# EAGLE design mainboard (EAGLE 5.10)
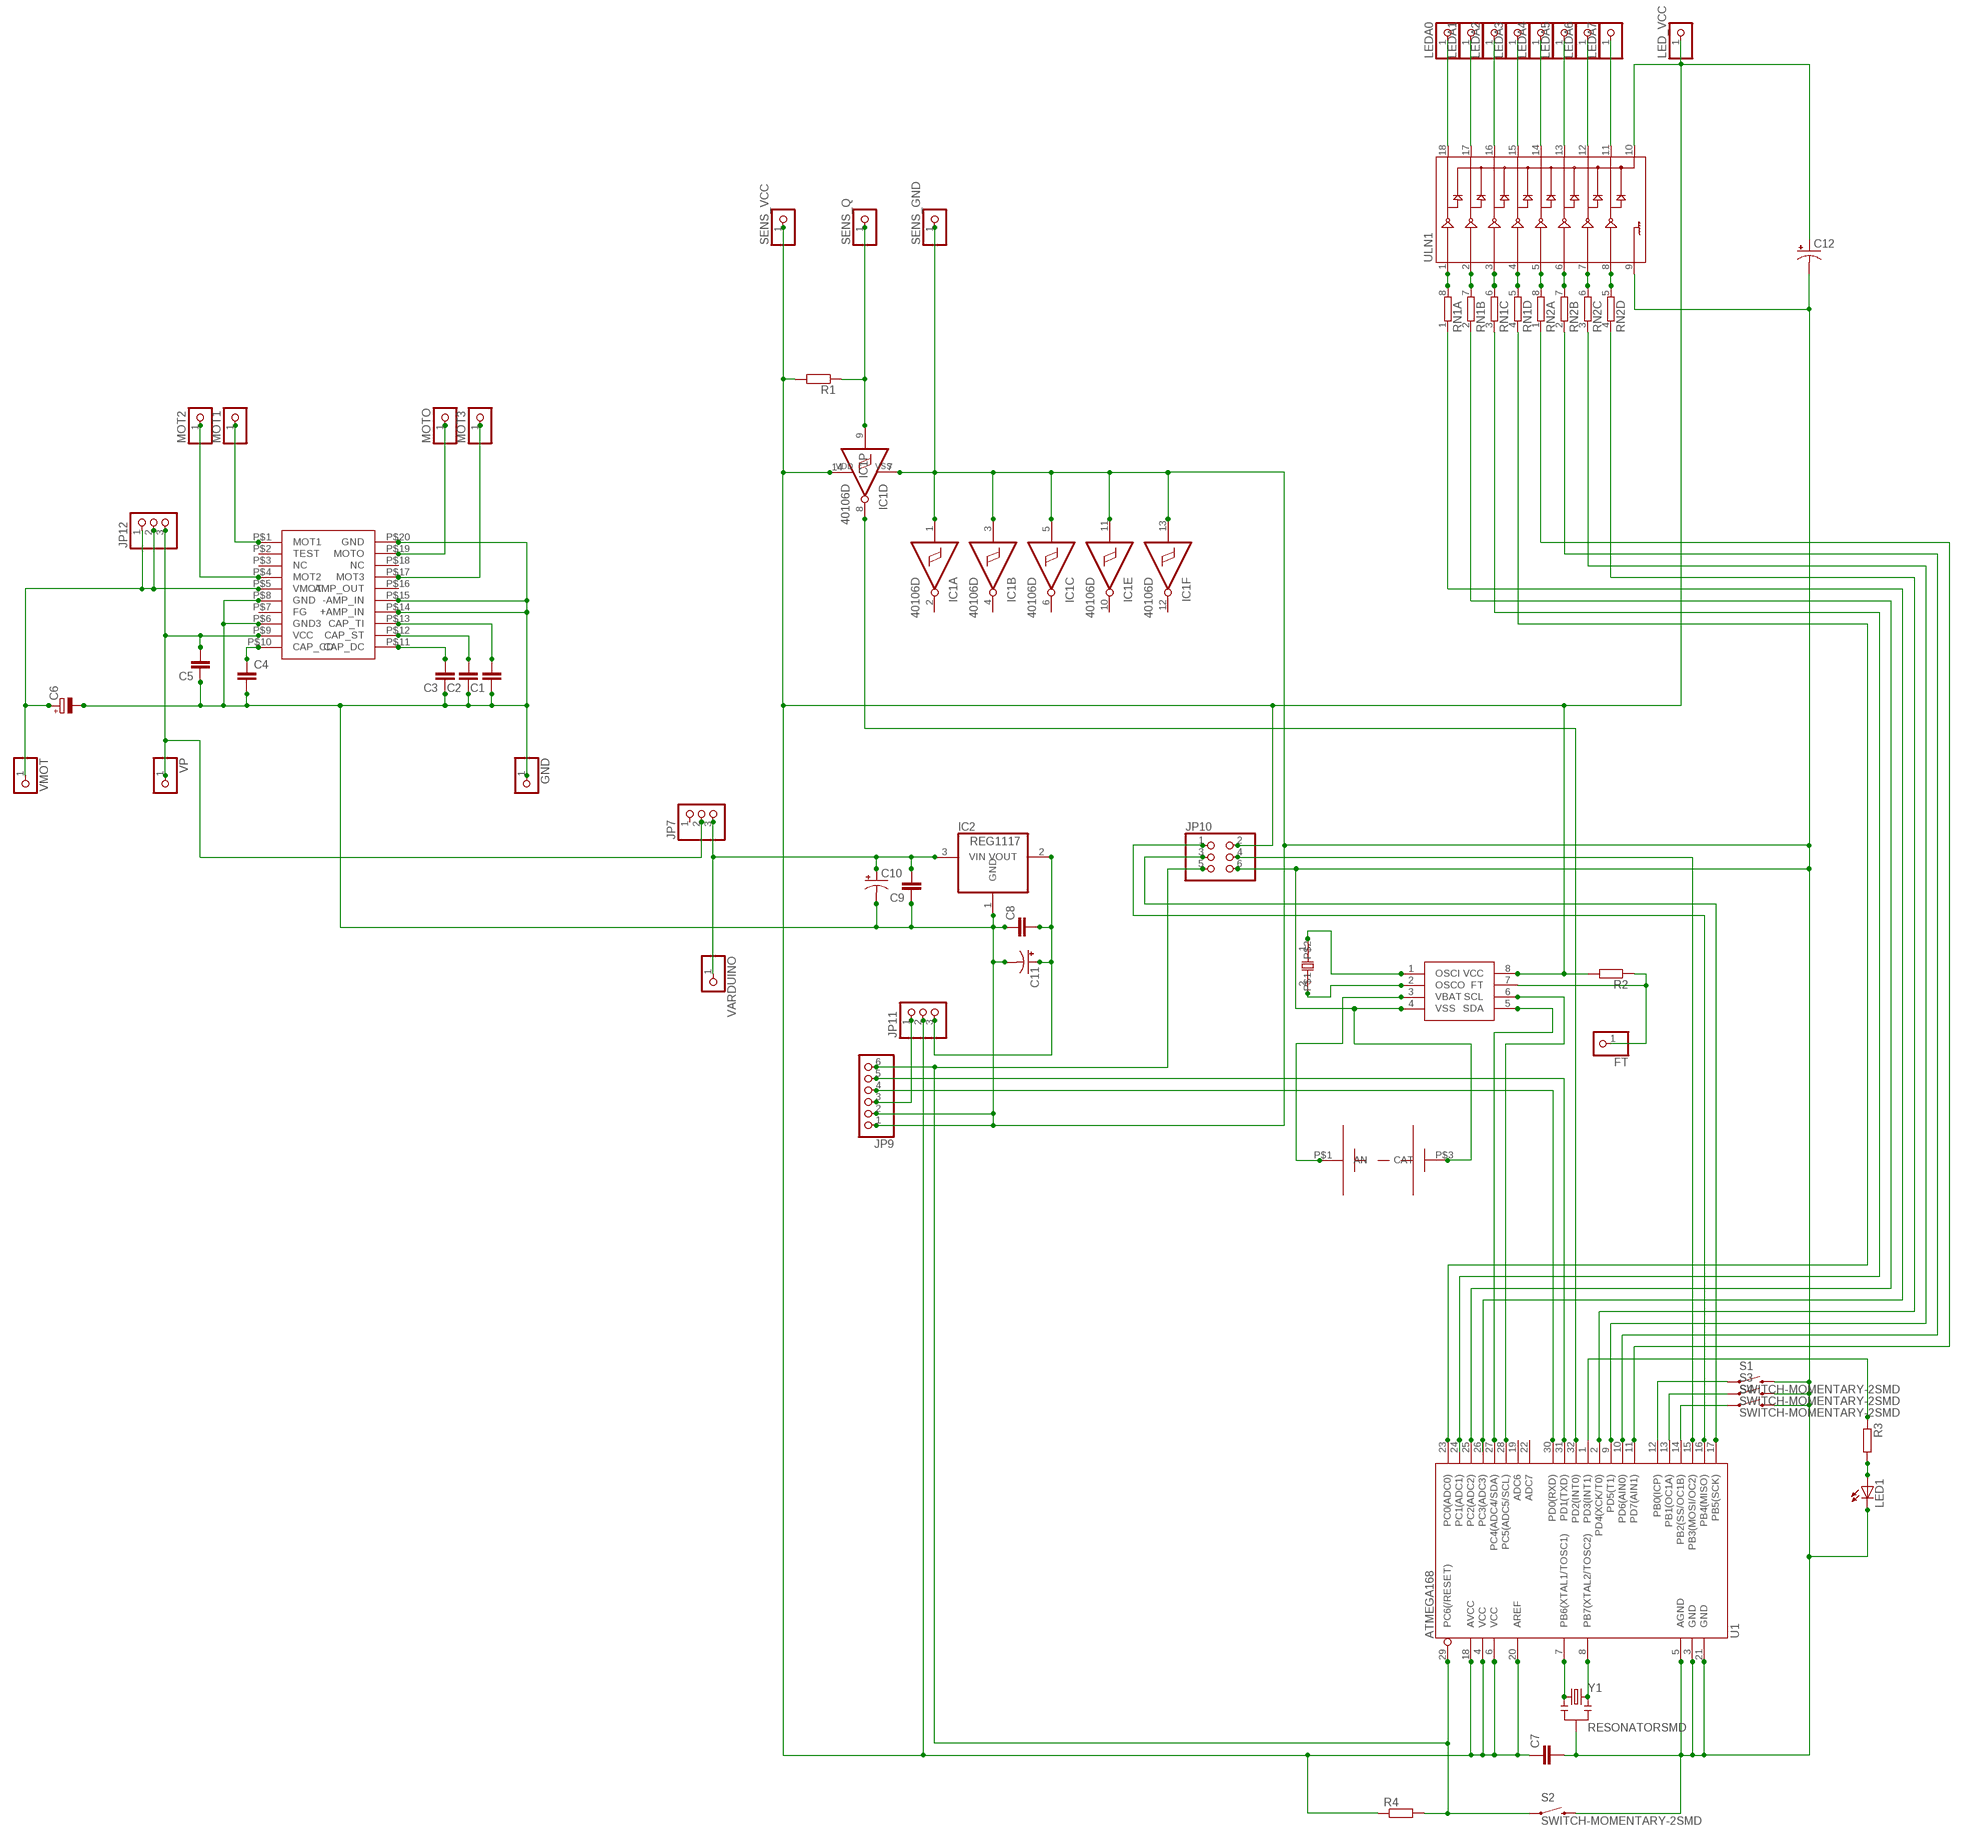
[diagram p0: schematic, sheet 1]

## Parts
C1  C-EUC0805  [C0805]
C2  C-EUC0805  [C0805]
C3  C-EUC0805  [C0805]
C4  C-EUC0805  [C0805]
C5  C-EUC0805  [C0805]
C6  CPOL-EUSMCD  [SMC_D]
C7  C-EUC0805  [C0805]
C8  C-EUC0805  [C0805]
C9  C-EUC0805  [C0805]
C10  CAP_POL3528  [EIA3528]
C11  CAP_POL3528  [EIA3528]
C12  CAP_POL3528  [EIA3528]
FT  PINHD-1X1  [1X01]
GND  PINHD-1X1  [1X01]
IC1  40106D  [SO14]
IC2  REG1117  [SOT223]
JP7  PINHD-1X3  [1X03]
JP9  PINHD-1X6  [1X06]
JP10  PINHD-2X3  [2X03]
JP11  PINHD-1X3  [1X03]
JP12  PINHD-1X3  [1X03]
LED1  LEDCHIP-LED0805  [CHIP-LED0805]
LED_VCC  PINHD-1X1  [1X01]
LEDA0  PINHD-1X1  [1X01]
LEDA1  PINHD-1X1  [1X01]
LEDA2  PINHD-1X1  [1X01]
LEDA3  PINHD-1X1  [1X01]
LEDA4  PINHD-1X1  [1X01]
LEDA5  PINHD-1X1  [1X01]
LEDA6  PINHD-1X1  [1X01]
LEDA7  PINHD-1X1  [1X01]
MOT1  PINHD-1X1  [1X01]
MOT2  PINHD-1X1  [1X01]
MOT3  PINHD-1X1  [1X01]
MOTO  PINHD-1X1  [1X01]
R1  R-EU_R0805  [R0805]
R2  R-EU_R0805  [R0805]
R3  R-EU_R0805  [R0805]
R4  R-EU_R0805  [R0805]
RN1  4R-N0603-ARV  [0603-ARV]
RN2  4R-N0603-ARV  [0603-ARV]
S1  SWITCH-MOMENTARY-2SMD  [TACTILE_SWITCH_SMD]
S2  SWITCH-MOMENTARY-2SMD  [TACTILE_SWITCH_SMD]
S3  SWITCH-MOMENTARY-2SMD  [TACTILE_SWITCH_SMD]
S4  SWITCH-MOMENTARY-2SMD  [TACTILE_SWITCH_SMD]
SENS_GND  PINHD-1X1  [1X01]
SENS_Q  PINHD-1X1  [1X01]
SENS_VCC  PINHD-1X1  [1X01]
U1  ATMEGA168  [TQFP32-08]
U$1  TDA5144  [SO20W]
U$2  M41T00RTC  [SO08]
U$3  SSP-T5XTAL  [SSP-T5XTAL]
U$4  CR1216LITHIUM  [CR1216]
ULN1  ULN2803SOICW  [SO18L]
VARDUINO  PINHD-1X1  [1X01]
VMOT  PINHD-1X1  [1X01]
VP  PINHD-1X1  [1X01]
Y1  RESONATORSMD  [RESONATOR-SMD]

## Nets
5V: C7.1 C12.A(+) IC1.14(P:VDD) JP10.2 JP11.2 LED_VCC.1 R1.2 R2.2 R4.1 SENS_VCC.1 U1.4(VCC) U1.6(VCC) U1.18(AVCC) U1.20(AREF) U$2.8(VCC) ULN1.10
GND: C1.1 C2.1 C3.1 C4.2 C5.1 C6.- C7.2 C8.1 C9.1 C10.C(-) C11.C(-) C12.C(-) GND.1 IC1.1(A:I) IC1.3(B:I) IC1.5(C:I) IC1.7(P:VSS) IC1.11(E:I) IC1.13(F:I) IC2.1(GND) JP9.1 JP9.2 JP10.6 LED1.C S1.3 S2.3 S3.3 S4.3 SENS_GND.1 U1.3(GND) U1.5(AGND) U1.21(GND) U$1.P$6(GND3) U$1.P$8(GND) U$1.P$14(+AMP_IN) U$1.P$15(-AMP_IN) U$1.P$20(GND) U$2.4(VSS) U$4.P$3(CAT) ULN1.9 Y1.2
N$1: MOT1.1 U$1.P$1(MOT1)
N$2: MOT2.1 U$1.P$4(MOT2)
N$3: MOTO.1 U$1.P$19(MOTO)
N$4: MOT3.1 U$1.P$17(MOT3)
N$5: RN1.8 ULN1.1
N$6: RN1.7 ULN1.2
N$7: RN1.6 ULN1.3
N$8: RN2.1 U1.11(PD7(AIN1))
N$9: C1.2 U$1.P$13(CAP_TI)
N$10: C2.2 U$1.P$12(CAP_ST)
N$11: C3.2 U$1.P$11(CAP_DC)
N$12: C4.1 U$1.P$10(CAP_CD)
N$13: RN1.5 ULN1.4
N$14: RN2.8 ULN1.5
N$15: RN2.7 ULN1.6
N$16: RN2.6 ULN1.7
N$17: RN2.5 ULN1.8
N$18: LEDA0.1 ULN1.18
N$19: LEDA1.1 ULN1.17
N$20: LEDA2.1 ULN1.16
N$21: LEDA3.1 ULN1.15
N$22: LEDA4.1 ULN1.14
N$23: LEDA5.1 ULN1.13
N$24: LEDA6.1 ULN1.12
N$25: LEDA7.1 ULN1.11
N$26: S3.1 U1.13(PB1(OC1A))
N$27: U1.28(PC5(ADC5/SCL)) U$2.6(SCL)
N$28: IC1.9(D:I) R1.1 SENS_Q.1
N$30: U1.7(PB6(XTAL1/TOSC1)) Y1.1
N$31: U1.8(PB7(XTAL2/TOSC2)) Y1.3
N$32: JP9.3 JP11.1
N$33: C8.2 C11.A(+) IC2.2(VOUT) JP11.3
N$34: JP9.5 U1.31(PD1(TXD))
N$35: JP9.4 U1.30(PD0(RXD))
N$36: JP10.3 U1.17(PB5(SCK))
N$37: JP10.1 U1.16(PB4(MISO))
N$38: JP10.4 U1.15(PB3(MOSI/OC2))
N$39: IC1.8(D:O) U1.32(PD2(INT0))
N$40: RN1.4 U1.23(PC0(ADC0))
N$41: C9.2 C10.A(+) IC2.3(VIN) JP7.3 VARDUINO.1
N$42: RN1.3 U1.24(PC1(ADC1))
N$43: RN1.2 U1.25(PC2(ADC2))
N$44: RN1.1 U1.26(PC3(ADC3))
N$45: RN2.4 U1.2(PD4(XCK/T0))
N$46: RN2.3 U1.9(PD5(T1))
N$47: RN2.2 U1.10(PD6(AIN0))
N$48: C6.+ JP12.1 JP12.2 U$1.P$5(VMOT) VMOT.1
N$49: U1.27(PC4(ADC4/SDA)) U$2.5(SDA)
N$51: U$2.1(OSCI) U$3.1
N$52: U$2.2(OSCO) U$3.2
N$53: FT.1 R2.1 U$2.7(FT)
N$55: R3.1 U1.1(PD3(INT1))
N$56: LED1.A R3.2
N$57: S4.1 U1.14(PB2(SS/OC1B))
N$58: S1.1 U1.12(PB0(ICP))
RESET: JP9.6 JP10.5 R4.2 S2.1 U1.29(PC6(/RESET))
VBAT: U$2.3(VBAT) U$4.P$1(AN)
VCC: C5.2 JP7.2 JP12.3 U$1.P$9(VCC) VP.1
Unconnected: IC1.2(A:O) IC1.4(B:O) IC1.6(C:O) IC1.10(E:O) IC1.12(F:O) JP7.1 U1.19(ADC6) U1.22(ADC7) U$1.P$2(TEST) U$1.P$3(NC) U$1.P$7(FG) U$1.P$16(AMP_OUT) U$1.P$18(NC)

## Library data of the parts
C1-C5 C7-C9 = rcl:C-EU: CAPACITOR, European symbol
C6 = rcl:CPOL-EU: POLARIZED CAPACITOR, European symbol
C10-C12 = SparkFun:CAP_POL: Capacitor Polarized These are standard SMD and PTH capacitors. Normally 10uF, 47uF, and 100uF in electrolytic and tantalum varieties. Always verify the external diameter of the through hole cap, it varies with capacity, voltage, and manufacturer. The EIA devices should be standard.
FT GND LED_VCC LEDA0 LEDA1-LEDA7 MOT1-MOT3 MOTO SENS_GND SENS_Q SENS_VCC VARDUINO VMOT VP = pinhead:PINHD-1X1: PIN HEADER
IC1 = 40xx:40106: Hex SCHMITT TRIGGER
IC2 = burr-brown:REG1117: 800mA and 1A Low Dropout (LDO) Positive Regulator 1.8V, 2.5V, 2.85V, 3.3V, 5V, and Adj
JP7 JP11 JP12 = pinhead:PINHD-1X3: PIN HEADER
JP9 = pinhead:PINHD-1X6: PIN HEADER
JP10 = pinhead:PINHD-2X3: PIN HEADER
LED1 = led:LED: LED OSRAM: - CHIPLED LG R971, LG N971, LY N971, LG Q971, LY Q971, LO R971, LY R971 LH N974, LH R974 LS Q976, LO Q976, LY Q976 LO Q996 - Hyper CHIPLED LW Q18S LB Q993, LB Q99A, LB R99A - SideLED LS A670, LO A670, LY A670, LG A670, LP A670 LB A673, LV A673, LT A673, LW A673 LH A674 LY A675 LS A676, LA A676, LO A676, LY A676, LW A676 LS A679, LY A679, LG A679 - Hyper Micro SIDELED® LS Y876, LA Y876, LO Y876, LY Y876 LT Y87S - SmartLED LW L88C, LW L88S LB L89C, LB L89S, LG L890 LS L89K, LO L89K, LY L89K LS L896, LA L896, LO L896, LY L896 - TOPLED LS T670, LO T670, LY T670, LG T670, LP T670 LSG T670, LSP T670, LSY T670, LOP T670, LYG T670 LG T671, LOG T671, LSG T671 LB T673, LV T673, LT T673, LW T673 LH T674 LS T676, LA T676, LO T676, LY T676, LB T676, LH T676, LSB T676, LW T676 LB T67C, LV T67C, LT T67C, LS T67K, LO T67K, LY T67K, LW E67C LS E67B, LA E67B, LO E67B, LY E67B, LB E67C, LV E67C, LT E67C LW T67C LS T679, LY T679, LG T679 LS T770, LO T770, LY T770, LG T770, LP T770 LB T773, LV T773, LT T773, LW T773 LH T774 LS E675, LA E675, LY E675, LS T675 LS T776, LA T776, LO T776, LY T776, LB T776 LHGB T686 LT T68C, LB T68C - Hyper Mini TOPLED® LB M676 - Mini TOPLED Santana® LG M470 LS M47K, LO M47K, LY M47K Source: http://www.osram.convergy.de LUXEON: - LUMILED® LXK2-PW12-R00, LXK2-PW12-S00, LXK2-PW14-U00, LXK2-PW14-V00 LXK2-PM12-R00, LXK2-PM12-S00, LXK2-PM14-U00 LXK2-PE12-Q00, LXK2-PE12-R00, LXK2-PE12-S00, LXK2-PE14-T00, LXK2-PE14-U00 LXK2-PB12-K00, LXK2-PB12-L00, LXK2-PB12-M00, LXK2-PB14-N00, LXK2-PB14-P00, LXK2-PB14-Q00 LXK2-PR12-L00, LXK2-PR12-M00, LXK2-PR14-Q00, LXK2-PR14-R00 LXK2-PD12-Q00, LXK2-PD12-R00, LXK2-PD12-S00 LXK2-PH12-R00, LXK2-PH12-S00 LXK2-PL12-P00, LXK2-PL12-Q00, LXK2-PL12-R00 Source: www.luxeon.com KINGBRIGHT: KA-3528ASYC Source: www.kingbright.com
R1-R4 = rcl:R-EU_: RESISTOR, European symbol
RN1 RN2 = resistor-dil:4R-N: Array Chip Resistor Source: RS Component / Phycomp
S1-S4 = SparkFun:SWITCH-MOMENTARY-2
U1 = SparkFun:ATMEGA168
U$1 = jasons_stuff:TDA5144
U$2 = jasons_stuff:M41T00RTC
U$3 = jasons_stuff:SSP-T5XTAL
U$4 = jasons_stuff:CR1216LITHIUM
ULN1 = SparkFun:ULN2803: Darlington Driver ULN2803 Darlington array. 500mA max per channel, 8-channel package. Spark Fun Electronics SKU : COM-00312
Y1 = SparkFun:RESONATOR: Resonator Small SMD resonator. This is the itty bitty 10/20MHz resonators with built in caps. CSTCE10M0G55 and CSTCE20M0V53. Footprint has been reviewed closely but hasn't been tested yet.

## Board
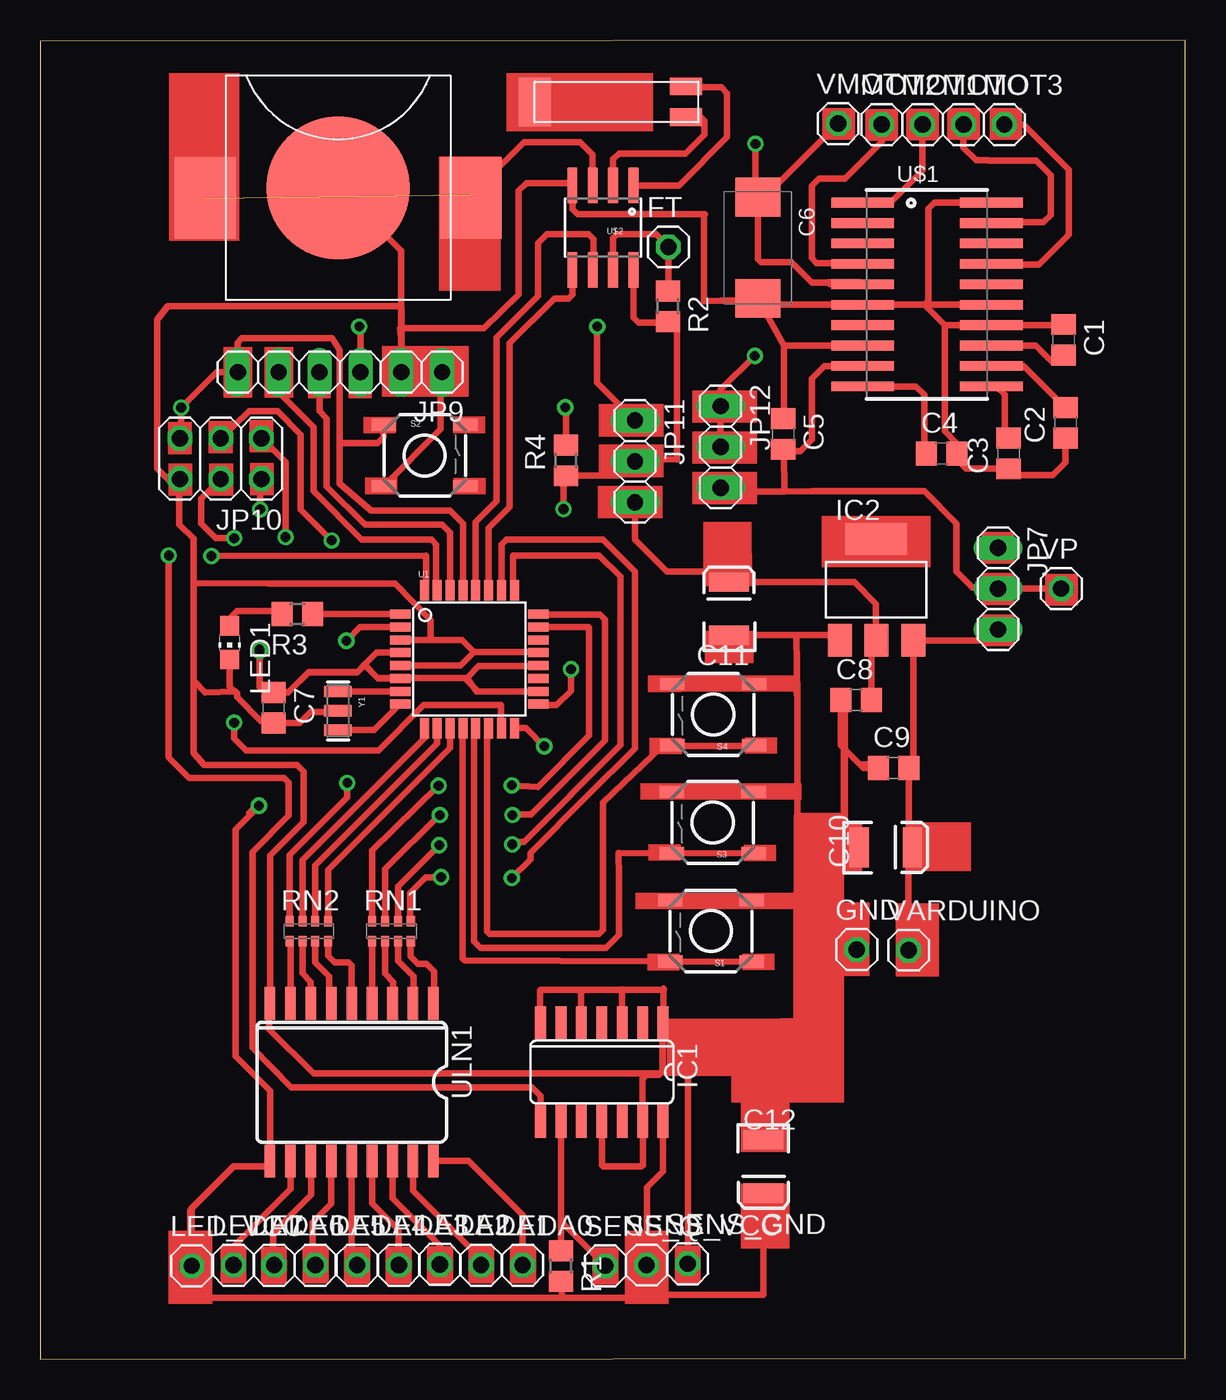
[diagram p1: board, top side]
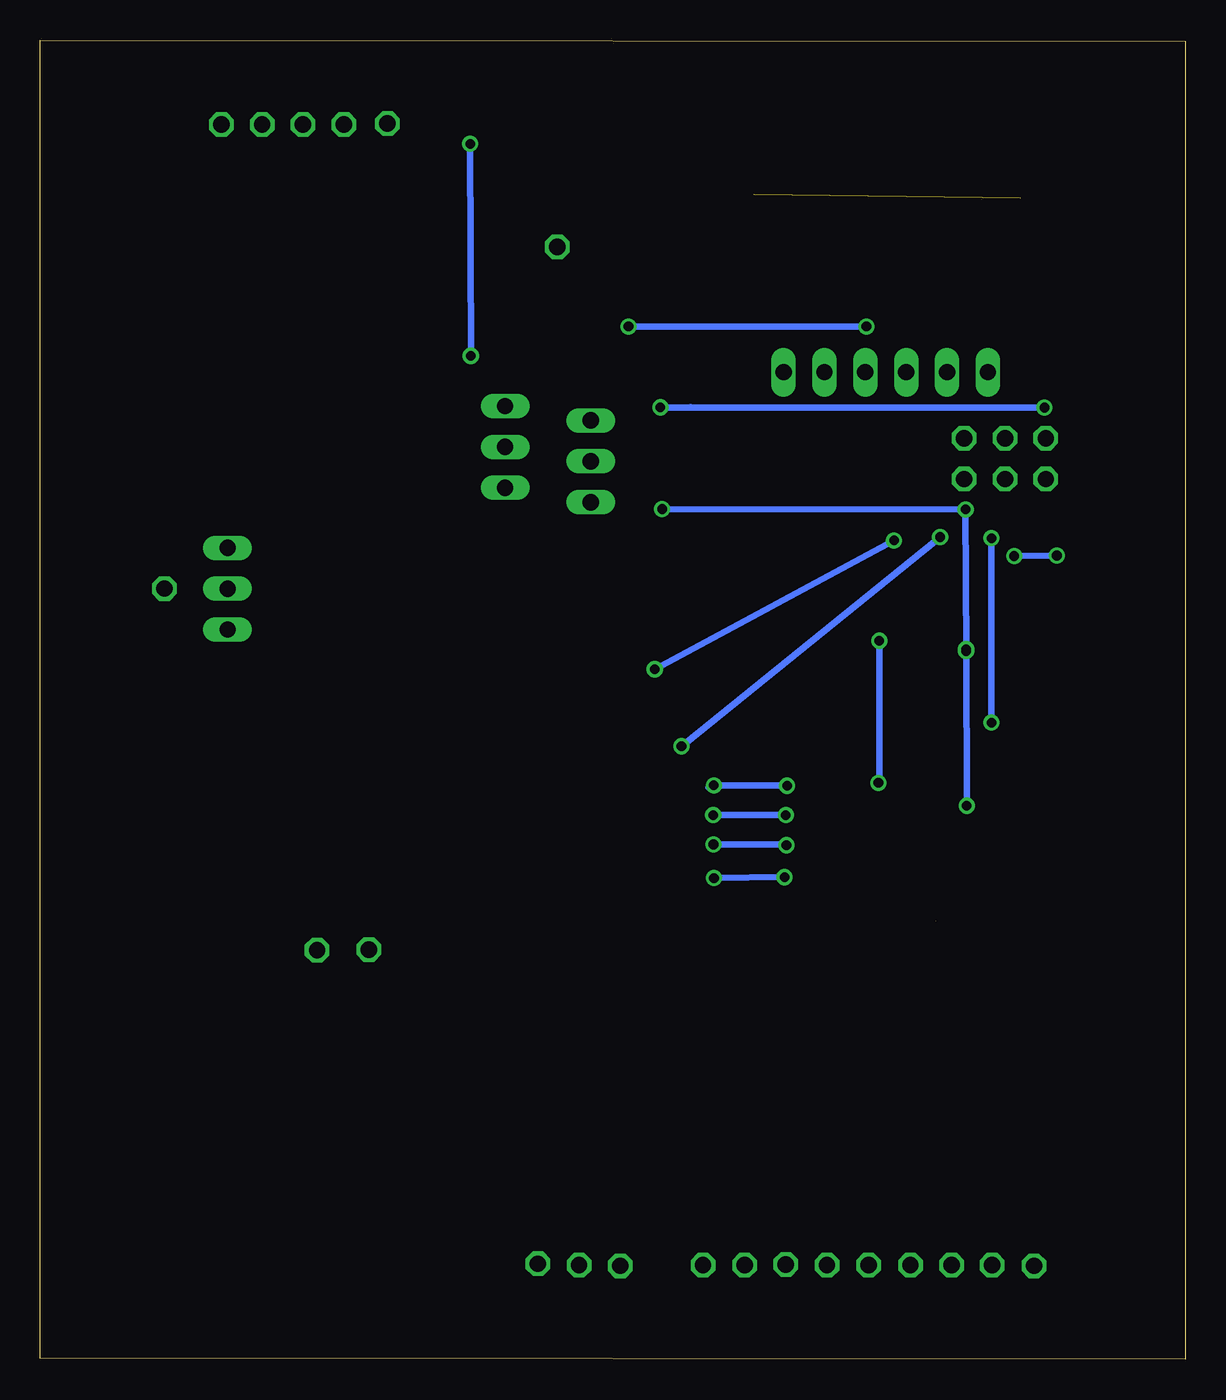
[diagram p2: board, bottom side, seen from below]

Size 71.25 x 82.06 mm. Coordinates in mm from the lower left corner, seen from the top.
Outline: 0,0 71.25,0.06 71.25,82.06 0,82 0,0
Copper layers (1*16): Top 0.035mm / dielectric 1.5mm / Bottom 0.035mm
Design rules "default": minimum track width 10mil, minimum drill 24mil, track to track 8mil, track to pad 8mil, pad to pad 8mil, via to via 8mil, smd to smd 8mil, copper to edge 40mil, drill to drill 8mil, minimum pad ring 10mil, minimum via ring 8mil, stop-mask expansion 4mil, vias tented up to drill 0mil, thermal gap 10mil

### Footprints (pad centres in the part's own frame; a part is rotated, then mirrored left to right if it is on the bottom)
C0805 = smd 1.3 x 1.5: 1 -0.95,0; 2 0.95,0
SMC_D = smd 2.4 x 2.8: + -3.15,0; - 3.15,0
EIA3528 = smd 1.2 x 2.5: A 1.65,0; C -1.65,0
1X01 = drill 1.016 octagon: 1 0,0
SO14 = smd 0.66 x 2.032: 1 -3.81,-3.073; 2 -2.54,-3.073; 3 -1.27,-3.073; 4 0,-3.073; 5 1.27,-3.073; 6 2.54,-3.073; 7 3.81,-3.073; 8 3.81,3.073; 9 2.54,3.073; 10 1.27,3.073; 11 0,3.073; 12 -1.27,3.073; 13 -2.54,3.073; 14 -3.81,3.073
SOT223 = smd 1.499 x 2.007: 1 -2.261,-3.15; 2 0.025,-3.15; 3 2.311,-3.15 | smd 3.81 x 2.007: 4 0,3.15
1X03 = drill 1.016 long: 1 -2.54,0; 2 0,0; 3 2.54,0
1X06 = drill 1.016 long: 1 -6.35,0; 2 -3.81,0; 3 -1.27,0; 4 1.27,0; 5 3.81,0; 6 6.35,0
2X03 = drill 1.016 octagon: 1 -2.54,-1.27; 2 -2.54,1.27; 3 0,-1.27; 4 0,1.27; 5 2.54,-1.27; 6 2.54,1.27
CHIP-LED0805 = smd 1.2 x 1.2: A 0,-1.05; C 0,1.05
R0805 = smd 1.3 x 1.5: 1 -0.95,0; 2 0.95,0
0603-ARV = smd 0.5 x 0.65: 1 -1.2,-0.625; 2 -0.4,-0.625; 3 0.4,-0.625; 4 1.2,-0.625; 5 1.2,0.625; 6 0.4,0.625; 7 -0.4,0.625; 8 -1.2,0.625
TACTILE_SWITCH_SMD = smd 1.524 x 0.762: 1 -2.54,1.905; 2 2.54,1.905; 3 -2.54,-1.905; 4 2.54,-1.905
TQFP32-08 = smd 1.27 x 0.559: 1 -4.293,2.8; 2 -4.293,2; 3 -4.293,1.2; 4 -4.293,0.4; 5 -4.293,-0.4; 6 -4.293,-1.2; 7 -4.293,-2; 8 -4.293,-2.8; 17 4.293,-2.8; 18 4.293,-2; 19 4.293,-1.2; 20 4.293,-0.4; 21 4.293,0.4; 22 4.293,1.2; 23 4.293,2; 24 4.293,2.8 | smd 0.559 x 1.27: 9 -2.8,-4.293; 10 -2,-4.293; 11 -1.2,-4.293; 12 -0.4,-4.293; 13 0.4,-4.293; 14 1.2,-4.293; 15 2,-4.293; 16 2.8,-4.293; 25 2.8,4.293; 26 2,4.293; 27 1.2,4.293; 28 0.4,4.293; 29 -0.4,4.293; 30 -1.2,4.293; 31 -2,4.293; 32 -2.8,4.293
SO20W = smd 0.6 x 3.9: P$1 -5.715,-4; P$2 -4.445,-4; P$3 -3.175,-4; P$4 -1.905,-4; P$5 -0.635,-4; P$6 0.635,-4; P$7 1.905,-4; P$8 3.175,-4; P$9 4.445,-4; P$10 5.715,-4; P$11 5.715,4; P$12 4.445,4; P$13 3.175,4; P$14 1.905,4; P$15 0.635,4; P$16 -0.635,4; P$17 -1.905,4; P$18 -3.175,4; P$19 -4.445,4; P$20 -5.715,4
SO08 = smd 0.61 x 2.21: 1 -1.905,-2.616; 2 -0.635,-2.616; 3 0.635,-2.616; 4 1.905,-2.616; 5 1.905,2.616; 6 0.635,2.616; 7 -0.635,2.616; 8 -1.905,2.616
SSP-T5XTAL = smd 2 x 1.1: 1 9.4,0.95; 2 9.4,-0.95 | smd 2 x 3: NC 0,0
CR1216 = smd 3.81 x 5.08: P$1 -8.89,0; P$2 7.62,0 | smd 8.89 x 8.89: P$3 -0.635,0.635
SO18L = smd 0.66 x 2.032: 1 -0.635,-4.902; 2 0.635,-4.902; 3 1.905,-4.902; 4 3.175,-4.902; 5 4.445,-4.902; 6 5.715,-4.902; 7 6.985,-4.902; 8 8.255,-4.902; 9 9.525,-4.902; 10 9.525,4.902; 11 8.255,4.902; 12 6.985,4.902; 13 5.715,4.902; 14 4.445,4.902; 15 3.175,4.902; 16 1.905,4.902; 17 0.635,4.902; 18 -0.635,4.902
RESONATOR-SMD = smd 0.7 x 1.7: 1 -1.2,0; 2 0,0; 3 1.2,0

### Placement (x,y rotation side)
C1  63.67,63.43 270 top
C2  63.79,58.26 90 top
C3  60.25,56.35 90 top
C4  56.08,56.35 0 top
C5  46.22,57.56 270 top
C6  44.65,69.14 270 top
C7  14.53,40.54 270 top
C8  50.77,41.01 0 top
C9  53.09,36.79 0 top
C10  52.61,31.85 0 top
C11  42.86,46.7 90 top
C12  45,12 270 top
FT  39.09,69.2 0 top
GND  50.8,25.49 0 top
IC1  34.94,17.88 180 top
IC2  52.01,47.88 0 top
JP7  59.59,47.94 270 top
JP9  18.65,61.41 180 top
JP10  11.23,56.03 180 top
JP11  37.01,55.86 270 top
JP12  42.33,56.76 270 top
LED1  11.79,44.58 180 top
LED_VCC  9.43,5.82 0 top
LEDA0  30.01,5.86 0 top
LEDA1  27.43,5.86 0 top
LEDA2  24.87,5.9 0 top
LEDA3  22.3,5.86 0 top
LEDA4  19.72,5.86 0 top
LEDA5  17.11,5.86 0 top
LEDA6  14.55,5.86 0 top
LEDA7  12.03,5.86 0 top
MOT1  54.9,76.81 0 top
MOT2  52.36,76.81 0 top
MOT3  59.98,76.81 0 top
MOTO  57.44,76.81 0 top
R1  32.39,5.81 270 top
R2  39.05,65.51 270 top
R3  16,46.37 180 top
R4  32.71,55.91 90 top
RN1  21.86,26.64 180 top
RN2  16.72,26.64 180 top
S1  41.73,26.64 180 top
S2  23.92,56.23 0 top
S3  41.84,33.4 180 top
S4  41.87,40.11 180 top
SENS_GND  40.29,5.94 0 top
SENS_Q  35.16,5.82 0 top
SENS_VCC  37.73,5.86 0 top
U1  26.7,43.56 0 top
U$1  55.17,66.24 270 top
U$2  35.01,70.4 180 top
U$3  30.77,78.22 0 top
U$4  19.17,72.25 0 top
ULN1  23.83,17.24 180 top
VARDUINO  54.03,25.45 0 top
VMOT  49.65,76.88 0 top
VP  63.52,47.95 0 top
Y1  18.53,40.34 270 top

### Tracks (layer width: path | path; a pad name or v marks a point on that pad's centre or on a via)
5V  (via drill 0.6)
  Top 0.406: 20.19,43.21 21.03,42.37 22.4,42.37 U1.6 26.57,42.4 | U1.4 20.94,43.96 20.19,43.21 | 26.57,42.4 27.29,43.14 30.83,43.14 U1.20 | 26.57,42.4 27.16,41.56 U1.18 27.23,41.56 26.4,42.39 20.99,42.39 20.17,43.21 20.17,43.17 19.76,42.76 16.72,42.76 15.47,41.51 13.97,41.51 13.64,41.84 v13.64,44.17 | U$2.8 36.91,64.8 37.22,64.49 38.51,64.49 | 38.51,64.49 38.98,64.49 R2.2 | 38.51,64.49 39.62,64.59 39.62,55.97 38,56 37.14,56 JP11.2 36.11,54.97 R4.1 32.56,54.82 v32.56,52.9 | 20.19,43.21 19.72,42.74 16.68,42.74 16.48,42.53 15.43,41.49 C7.1 14.06,41.49 13.65,41.9 v13.65,44.07 | JP10.2 13.68,54.68 v13.68,52.87 | IC1.14 38.75,11.68 37.75,10.69 37.75,5.89 SENS_VCC.1 37.8,5.79 37.8,4.68 37.06,3.94 | LED_VCC.1 9.43,9.43 12,12 13.96,12 ULN1.10 | ULN1.10 14.3,12.02 14.32,12 12.06,12 9.34,9.28 9.34,4.42 9.94,3.83 32.52,3.83 | 32.52,3.83 36.95,3.83 37.06,3.94 | 13,34 13.44,34.44 v13.61,34.44 12.15,32.98 12.15,18.85 14.3,16.7 ULN1.10 | C12.A 45,4 37.06,4 37.06,3.94 | R1.2 32.47,3.88 32.52,3.83
  Bottom 0.406: v13.65,44.07 v13.68,52.87 v32.56,52.9 | v13.61,34.44 v13.64,44.17
GND
  Top 0.406: 18.39,40.2 Y1.2 18.46,40.28 16.82,40.28 16.13,39.59 C7.2 14.39,39.72 13.73,39.72 12.26,41.19 12.26,41.44 | 27,44 26.24,44.76 U1.3 24.27,44.76 24.28,44.76 24.28,45.98 22.07,48.27 14.19,48.27 9.54,48.29 | 27,44 30.95,44 U1.21 | U1.5 26.16,43.16 27,44 | LED1.C 11.79,41.86 12.21,41.44 12.26,41.44 | 9.54,42.23 9.54,48.29 | 9.54,42.23 10.27,41.5 12.16,41.53 12.26,41.44 | JP9.2 JP9.1 | JP9.2 22.46,63.55 | 22.46,63.55 22.39,64.16 27.61,64.16 29.77,66.24 29.77,72.69 30.26,73.18 32.94,73.18 U$2.4 33.11,71.56 33.44,71.22 41.36,71.22 41.31,71.25 41.28,65.84 42.36,65.85 44.5,65.85 C6.- | JP9.2 24.78,61.41 24.91,61.28 24.91,57.85 S2.3 24.91,57.86 24.91,59.59 24.91,59.6 24.91,61.43 24.89,61.41 22.47,61.41 22.48,61.42 22.48,65.41 22.38,65.51 7.92,65.51 7.28,64.67 7.28,55.41 7.93,54.76 JP10.6 8.65,54.73 8.65,51.94 9.54,51.05 9.54,48.29 | 22.46,63.55 22.46,68.96 U$4.P$3 | 9.54,42.23 9.55,42.23 | IC2.1 49.43,45.05 C11.C 45.95,45.05 47.06,45.07 47.1,41.18 | 47.1,41.18 46.99,42.02 45.98,42.01 S4.3 | S3.3 47.12,35.27 47.1,35.18 | 47.1,35.18 47.1,41.18 | S1.3 47.15,28.54 47.05,28.97 | 47.05,28.97 47.11,29.44 47.11,34.55 47.1,35.18 | C8.1 49.81,41 | C8.1 49.82,38.18 50,38 | 50,38 51,37 | 51,37 51.93,37 C9.1 51.21,36.79 51,37 | 50,38 50,32.81 C10.C 49,31.85 49,25 50.8,25 GND.1 50.96,25.65 | IC1.1 44.95,20.95 45,21 | 47.06,22.55 47.06,21.04 45,21 | 47.06,22.55 47.05,28.97 | IC1.7 31.11,22.96 31.13,22.99 33.64,22.99 33.65,23 | 33.65,23 33.65,20.97 IC1.5 | IC1.3 36.21,23.01 36.2,23 | 36.2,23 33.65,23 | IC1.1 38.79,23.07 38.8,22.98 36.2,23 | IC1.11 34.94,12.06 35,12 37.41,12 37.49,12.07 IC1.13 37.48,17.45 37.72,17.69 38.49,17.69 38.76,17.95
  Top 0.406: 38.76,17.95 IC1.1 | SENS_GND.1 40.29,17.46 39.94,17.81 38.91,17.81 38.76,17.95 | 9.54,42.23 9.54,37.72 10.19,36.98 15.98,36.98 16.39,36.57 16.39,33.44 14.3,31.34 ULN1.9 14.23,22.07 14.23,20.52 17.02,17.78 29.8,17.78 31.22,17.78 38.52,17.78 38.73,17.98 38.73,20.61 39,20.89 39,21 45,21 | C6.- 45.03,65.6 U$1.P$6 55,65.6 | 55,65.6 U$1.P$15 | 56.27,64.34 U$1.P$14 63.62,64.34 C1.1 | 55,65.6 56.27,64.34 | C2.1 63.79,55.79 63,55 60.65,55 C3.1 57.6,55.4 57,56 57,56.33 C4.2 57,56.38 57,57 56.27,57.73 56.27,64.34 | 46.27,63.06 U$1.P$8 | C6.- 46.27,63.06 | 46.27,63.06 46.27,58.86 C5.1 | U$1.P$20 55.62,71.95 55.25,71.58 55.25,65.86 55,65.6 | 47.06,22.55 47.09,32.66 | 47.09,32.66 47.1,35.18 | 45,21 C12.C | C8.1 50.05,41.01 50.05,32.75 47.09,32.75 47.09,32.66
N$1
  Top 0.406: U$1.P$1 51.22,71.9 52.84,71.9 54.9,73.96 MOT1.1
N$2
  Top 0.406: U$1.P$4 51.12,68.19 48.3,68.19 48,68.49 48,73 48.46,73.46 50.08,73.46 52.36,75.75 MOT2.1
N$3
  Top 0.406: U$1.P$19 59.23,70.62 59.72,70.62 59.83,70.73 62.41,70.73 62.87,71.19 62.87,73.67 61.99,74.56 59.01,74.56 58.98,74.6 58.23,74.6 57.44,75.39 MOTO.1
N$4
  Top 0.406: MOT3.1 61.19,76.81 64,74 64,69.98 62.13,68.11 59.21,68.11 U$1.P$17
N$5
  Top 0.406: RN1.8 23.06,25.05 23.52,24.59 24.05,24.59 24.51,24.13 24.51,22.19 ULN1.1
N$6
  Top 0.406: RN1.7 22.26,24.79 23.24,23.81 23.24,22.19 ULN1.2
N$7
  Top 0.406: RN1.6 21.46,23.99 21.96,23.49 21.96,22.18 ULN1.3
N$8
  Top 0.406: U1.11 25.51,39.26 25.51,38.05 17.91,30.45 RN2.1
N$9
  Top 0.406: U$1.P$13 61.94,63.06 63,62 63.19,62 C1.2
N$10
  Top 0.406: U$1.P$12 61.2,61.8 C2.2
N$11
  Top 0.406: U$1.P$11 59.48,60.52 60,60 60,57.55 C3.2
N$12
  Top 0.406: U$1.P$10 54.48,60.52 55,60 55,56.48 C4.1
N$13
  Top 0.406: RN1.5 ULN1.4
N$14
  Top 0.406: RN2.8 17.91,25.09 18.31,24.7 19.2,24.7 19.37,24.52 19.37,22.15 ULN1.5
N$15
  Top 0.406: RN2.7 17.12,24.69 17.99,23.81 17.99,22.26 ULN1.6
N$16
  Top 0.406: RN2.6 16.32,24 16.82,23.49 16.82,22.16 ULN1.7
N$17
  Top 0.406: ULN1.8 15.57,25.96 RN2.5
N$18
  Top 0.406: ULN1.18 26.66,12.34 30,9 30,5.87 LEDA0.1
N$19
  Top 0.406: LEDA1.1 27.43,6.25 23.21,10.47 23.21,12.32 ULN1.17
N$20
  Top 0.406: ULN1.16 21.92,10.01 24.87,7.06 LEDA2.1
N$21
  Top 0.406: LEDA3.1 22.3,8.06 20.66,9.7 ULN1.15
N$22
  Top 0.406: ULN1.14 19.38,6.2 LEDA4.1
N$23
  Top 0.406: ULN1.13 18.11,9.67 16.95,8.51 16.95,6.02 LEDA5.1
N$24
  Top 0.406: ULN1.12 16.84,10.23 14.49,7.87 14.49,5.92 LEDA6.1
N$25
  Top 0.406: LEDA7.1 12.03,7.03 15.59,10.6 15.59,12.32 ULN1.11
N$26
  Top 0.406: U1.13 27,39.17 27,26 27.39,25.61 35.21,25.61 36,26.39 36,30 35.99,31.49 44.25,31.46 44.61,31.48 44.31,31.42 S3.1
N$27
  Top 0.406: U1.28 27.1,52.09 28.39,53.38 28.39,63.56 30.97,66.13 30.97,69.44 31.52,70 34.11,70 34.42,69.69 34.42,67.83 U$2.6
N$28
  Top 0.406: 32.4,8.76 32.4,8.58 SENS_Q.1 | 32.4,8.76 IC1.9 | R1.1 32.4,9.05 32.4,8.76
N$30
  Top 0.406: Y1.1 22.39,41.54 U1.7
N$31
  Top 0.406: U1.8 22.4,40.76 20.78,39.15 Y1.3
N$32  (via drill 0.6)
  Top 0.406: JP9.3 19.92,64.18 v19.85,64.25 | v34.65,64.25 34.65,60.76 JP11.1
  Bottom 0.406: v19.85,64.25 v34.65,64.25
N$33
  Top 0.406: JP11.3 37.01,50.99 39,49 42.21,49 C11.A 50.65,48.35 52,47 52,45 | 52,44.77 52,44 | C8.2 51.72,44.72 52,45 | 52,45 52,44.77 | 52,44.77 IC2.2
N$34
  Top 0.406: JP9.5 14.84,60.16 17,58 17,54 20,51 24.34,51 24.64,50.7 24.64,47.92 U1.31
N$35
  Top 0.406: JP9.4 17.38,58.98 17.81,58.52 17.81,54.3 20.21,51.93 24.99,51.93 25.49,51.43 U1.30
N$36  (via drill 0.6)
  Top 0.406: U1.17 31.06,40.69 32.14,40.69 33.02,41.58 v33.02,42.93 | v18.13,50.94 16.22,52.85 16.22,57.54 14.76,58.99 14.55,58.99 14.54,59 13,59 12.08,58.08 JP10.3
  Bottom 0.406: v18.13,50.94 v33.02,42.93
N$37  (via drill 0.6)
  Top 0.406: JP10.1 15.26,55.81 v15.26,51.15 | U1.16 30.23,39.27 v31.36,38.14
  Bottom 0.406: v31.36,38.14 v15.26,51.15
N$38  (via drill 0.6)
  Top 0.406: U1.15 28.69,39.28 28.69,40.71 23.86,40.71 21.04,37.89 12.81,37.89 12.07,38.63 v12.07,39.61 | JP10.4 10,53.53 10,52 10.92,51.08 v12.07,51.08
  Bottom 0.406: v12.07,39.61 v12.07,51.08
N$39  (via drill 0.6)
  Top 0.406: v10.66,49.98 24,50 24,47.95 U1.32 | v8,50 8,37.43 9.25,36.17 15.17,36.17 15.46,35.88 15.46,33.83 13.21,31.58 13.21,19.36 15.62,16.92 30.6,16.92 31.14,16.39 IC1.8
  Bottom 0.406: v8,50 v10.66,49.98
N$40  (via drill 0.6)
  Top 0.406: RN1.4 20.66,31.66 v24.79,35.69 | v29.34,35.71 30.97,35.62 34.16,38.81 34.16,45.52 34.12,45.55 31,45.55 U1.23
  Bottom 0.406: 29.69,35.58 v29.34,35.71 29.32,35.69 v24.79,35.69
N$41
  Top 0.406: VARDUINO.1 54.03,31.62 C10.A 54.04,32.07 C9.2 54.32,37.08 IC2.3 58.92,44.73 JP7.3
N$42  (via drill 0.6)
  Top 0.406: RN1.3 21.46,30.51 v24.86,33.86 | U1.24 31.02,46.33 34.83,46.33 35.15,46.01 35.15,38.51 30.54,33.9 29.42,33.9 v29.38,33.86
  Bottom 0.406: v24.86,33.86 v29.37,33.86 v29.38,33.86
N$43  (via drill 0.6)
  Top 0.406: RN1.2 22.26,29.42 v24.82,31.98 | U1.25 29.42,47.93 29.42,50.01 34.78,50.01 36.11,48.68 36.11,38.21 33,35.1 33,35.09 30.09,32.18 29.52,32.18 v29.37,32.03 29.39,32
  Bottom 0.406: v29.37,32.03 24.87,32.03 v24.82,31.98
N$44  (via drill 0.6)
  Top 0.406: U1.26 28.7,50.7 29,51 35,51 37,49 37,38 34,35 33.99,35 30.51,31.51 30.51,31.11 v29.34,29.94 | v24.94,29.99 23.99,29.99 23,29 23,27.32 RN1.1
  Bottom 0.406: v29.34,29.94 24.96,30 v24.94,29.99
N$45  (via drill 0.6)  (1 unrouted)
  Top 0.406: U1.2 19.91,45.56 v19.05,44.7 | v19.1,35.86 19.1,34.94 15.53,31.37 15.53,27.27
  Bottom 0.406: v19.05,44.7 19.05,35.91 v19.1,35.86
N$46
  Top 0.406: U1.9 23.9,38.65 16.32,31.07 RN2.3
N$47
  Top 0.406: RN2.2 17.12,30.72 24.7,38.3 U1.10
N$48  (via drill 0.6)
  Top 0.406: 49,67 51,67 | U$1.P$5 49.12,66.88 49,67 | C6.+ 44.65,68.45 44.83,68.27 46.73,68.27 48.01,66.98 48.98,66.98 49,67 | C6.+ 45.06,72.3 VMOT.1 | JP12.2 JP12.1 42.33,60.33 v44.46,62.42 | C6.+ 45,72.65 | v44.5,75.62 44.5,72.44 C6.+
  Bottom 0.406: v44.46,62.42 v44.5,75.62
N$49
  Top 0.406: U1.27 27.9,51.71 29.22,53.02 29.22,63.22 31.99,66 32.88,66 33.12,66.23 U$2.5
N$51
  Top 0.406: U$2.1 39.74,73.02 42.74,76.02 42.74,78.78 42.37,79.14 40.2,79.14 U$3.1
N$52
  Top 0.406: U$2.2 35.64,74.64 36,75 40.15,75 41.34,76.19 41.34,77.05 41.04,77.35 40.24,77.35 U$3.2
N$53
  Top 0.406: U$2.7 35.64,69.74 35.89,69.98 38.31,69.98 FT.1 39.09,66.49 R2.1
N$55
  Top 0.406: U1.1 R3.1
N$56
  Top 0.406: LED1.A 11.79,46.09 12.25,46.54 14.88,46.54 R3.2
N$57
  Top 0.406: U1.14 27.81,39.18 27.81,26.61 27.95,26.47 34.76,26.47 35,26.71 35,34.64 38.71,38.16 44.44,38.16 44.41,38.1 S4.1
N$58
  Top 0.406: S1.1 26.44,24.8 26.27,24.93 26.27,38.89 U1.12
RESET  (via drill 0.6)
  Top 0.406: U1.29 26.3,51.98 25.49,52.79 20.59,52.79 18.64,54.47 18.64,57 | 18.64,58.11 18.64,62.79 18.18,63.52 12.54,63.52 12.27,63.25 12.27,61.44 JP9.6 10.98,61.41 v8.77,59.2 8.77,57.39 JP10.5 | 18.64,58.11 18.64,57 | 18.64,58.11 18.62,58.13 | S2.1 21.38,57.38 21,57 18.64,57 | R4.2 32.71,58.42 v32.67,59.22
  Bottom 0.406: v8.77,59.2 30.75,59.2 | 30.75,59.2 30.79,59.24 | v32.67,59.22 30.82,59.22 30.75,59.2
VBAT  (1 unrouted)
  Top 0.406: U$2.3 34.38,74.95 33.59,75.73 30.12,75.73 26.85,72.47
VCC
  Top 0.406: VP.1 JP7.2 59.53,48 58,48 57,49 57,52 55,54 48,54 46.29,53.99 | 46.29,53.99 46.26,56.48 C5.2 46.32,56.51 47.3,56.51 48,57.22 48,61 48.8,61.8 U$1.P$9 | 46.29,53.99 42.56,53.99 JP12.3
(copper drawn outside any net)
  shapes: Top area x75